# Altium schematic sheet IoExpander.SchDoc
size A4; DocumentNumber: 6; SheetNumber: 6; SheetTotal: 15
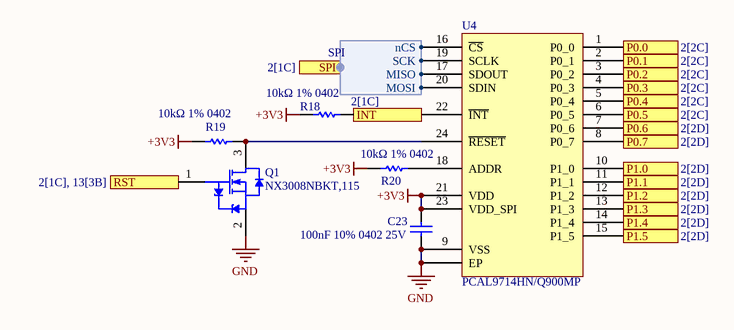
[diagram p0: IoExpander.SchDoc]

## Parts
C23  100nF 10% 0402 25V  [0402N]
Q1  NX3008NBKT,115  [NXP-SOT416_B_L]
R18  10kΩ 1% 0402  [0402N]
R19  10kΩ 1% 0402  [0402N]
R20  10kΩ 1% 0402  [0402N]
U4  PCAL9714HN/Q900MP  [PCAL9714HN_Q900MP-Footprint-1]

## Ports
INT (out, see 2[1C]), P0.0 (in, see 2[2C]), P0.1 (in, see 2[2C]), P0.2 (in, see 2[2C]), P0.3 (in, see 2[2C]), P0.4 (in, see 2[2C]), P0.5 (in, see 2[2C]), P0.6 (in, see 2[2D]), P0.7 (in, see 2[2D]), P1.0 (in, see 2[2D]), P1.1 (in, see 2[2D]), P1.2 (in, see 2[2D]), P1.3 (in, see 2[2D]), P1.4 (in, see 2[2D]), P1.5 (in, see 2[2D]), RST (in, see 2[1C], 13[3B]), SPI (harness SPI, see 2[1C])

## Harnesses
SPI: nCS, SCK, MISO, MOSI

## Nets
+3V3: C23.2 R18.2 R19.2 R20.2 U4.21(VDD) U4.23(VDD_SPI)
GND: C23.1 Q1.2(S) U4.9(VSS) U4.EP
INT: R18.1 U4.22(~{INT}) ; port INT
P0.0: U4.1(P0_0) ; port P0.0
P0.1: U4.2(P0_1) ; port P0.1
P0.2: U4.3(P0_2) ; port P0.2
P0.3: U4.4(P0_3) ; port P0.3
P0.4: U4.5(P0_4) ; port P0.4
P0.5: U4.6(P0_5) ; port P0.5
P0.6: U4.7(P0_6) ; port P0.6
P0.7: U4.8(P0_7) ; port P0.7
P1.0: U4.10(P1_0) ; port P1.0
P1.1: U4.11(P1_1) ; port P1.1
P1.2: U4.12(P1_2) ; port P1.2
P1.3: U4.13(P1_3) ; port P1.3
P1.4: U4.14(P1_4) ; port P1.4
P1.5: U4.15(P1_5) ; port P1.5
RST: Q1.1(G) ; port RST
NetQ1_3: Q1.3(D) R19.1 U4.24(~{RESET})
NetR20_1: R20.1 U4.18(ADDR)
NetU4_16: U4.16(~{CS}) ; port SPI.nCS
NetU4_17: U4.17(SDOUT) ; port SPI.MISO
NetU4_19: U4.19(SCLK) ; port SPI.SCK
NetU4_20: U4.20(SDIN) ; port SPI.MOSI

## Library data of the parts
C23 = C0402: Capacitance: 100n; Tolerance: 10; Voltage: 25; Footprint: 0402
Q1 = CMP-1259-00268-1: N-Channel Trench MOSFET, 30 V, 0.35 A, -55 to 150 degC, 3-Pin SOT416, Tape and Reel; Manufacturer: NXP Semiconductors; Automotive Qualified: Y; ID [max] (A): 0.35; IDM [max] (A): 1.4; VDS [max] (V): 30; Channel Type: N; VGSth [typ] (V): 0.9; Packing: Tape & Reel; DatasheetVersion: Rev. 1; PackageVersion: 06-03-16, 03/2006; ComponentLink2Description: Datasheet; PartNumber: NX3008NBKT,115; ComponentLink3URL: http://www.nxp.com/documents/data_sheet/2N7002PT.pdf; ComponentLink2URL: http://www.nxp.com/documents/data_sheet/NX3008NBKT.pdf; Code_JEITA: SC-75; PackageReference: SOT416_B; ComponentLink3Description: Package Specification; PackageDescription: 3-Pin Small Outline Transistor Package, Body 1.6 x 0.8 mm, Pitch 0.5 mm; Mounting Technology: Surface Mount; ComponentLink1URL: http://www.nxp.com/; ComponentLink1Description: Manufacturer URL
R18-R20 = R0402: Resistance: 10k; Tolerance: 1; Footprint: 0402
U4 = CMP-015-00014-1: Low-voltage Translating 14-BIT Spi I/o Expander - AEC_Q100 Compliant